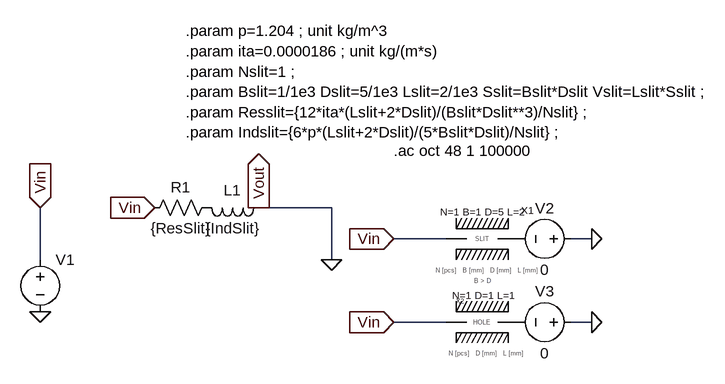
[diagram p0: schematic Slit_test.asc]
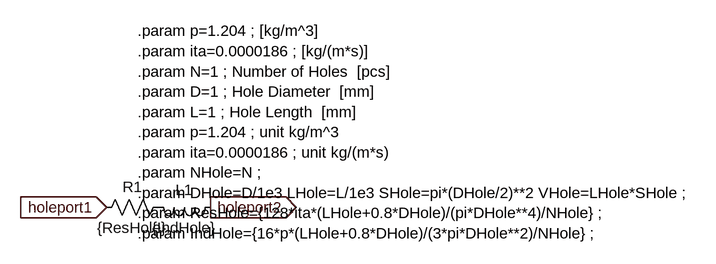
[diagram p1: sub-circuit holemodel.asc]
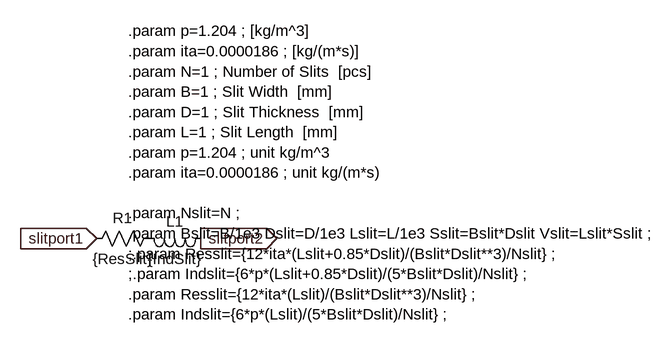
[diagram p2: sub-circuit slitmodel.asc]
Slit_test.asc, the LTspice schematic file:
Version 4
SHEET 1 1264 680
WIRE 432 432 320 432
WIRE 608 480 528 480
WIRE 832 480 800 480
WIRE -16 512 -16 432
WIRE 432 512 432 432
WIRE 608 608 528 608
WIRE 832 608 800 608
FLAG 160 432 Vin
IOPIN 160 432 In
FLAG 320 432 Vout
IOPIN 320 432 Out
FLAG -16 592 0
FLAG 432 512 0
FLAG -16 432 Vin
IOPIN -16 432 In
FLAG 832 480 0
FLAG 832 608 0
FLAG 528 608 Vin
IOPIN 528 608 In
FLAG 528 480 Vin
IOPIN 528 480 In
SYMBOL res 256 416 R90
WINDOW 0 0 56 VBottom 2
WINDOW 3 32 56 VTop 2
SYMATTR InstName R1
SYMATTR Value {ResSlit}
SYMBOL ind 336 416 R90
WINDOW 0 5 56 VBottom 2
WINDOW 3 32 56 VTop 2
SYMATTR InstName L1
SYMATTR Value {IndSlit}
SYMBOL voltage -16 496 R0
SYMATTR InstName V1
SYMATTR Value ""
SYMATTR Value2 AC 1
SYMBOL voltage 816 480 R90
WINDOW 0 -32 56 VBottom 2
WINDOW 3 32 56 VTop 2
SYMATTR InstName V2
SYMATTR Value 0
SYMATTR SpiceLine Rser=0
SYMBOL voltage 816 608 R90
WINDOW 0 -32 56 VBottom 2
WINDOW 3 32 56 VTop 2
SYMATTR InstName V3
SYMATTR Value 0
SYMATTR SpiceLine Rser=0
SYMBOL My_symbol/Holemodel 624 576 R0
WINDOW 0 0 0 Left 0
WINDOW 39 -6 -9 Left 1
SYMATTR InstName X2
SYMATTR SpiceLine N=1 D=1 L=1
SYMBOL My_symbol/SlitModel 624 448 R0
WINDOW 39 -25 -10 Left 1
SYMATTR InstName X1
SYMATTR SpiceLine N=1 B=1 D=5 L=2
TEXT 208 160 Left 2 !.param p=1.204 ; unit kg/m^3\n.param ita=0.0000186 ; unit kg/(m*s)\n.param Nslit=1 ;\n.param Bslit=1/1e3 Dslit=5/1e3 Lslit=2/1e3 Sslit=Bslit*Dslit Vslit=Lslit*Sslit ;\n.param Resslit={12*ita*(Lslit+2*Dslit)/(Bslit*Dslit**3)/Nslit} ;\n.param Indslit={6*p*(Lslit+2*Dslit)/(5*Bslit*Dslit)/Nslit} ;
TEXT 528 344 Left 2 !.ac oct 48 1 100000

holemodel.asc, the sub-circuit schematic file:
Version 4
SHEET 1 1216 680
FLAG 160 432 holeport1
IOPIN 160 432 In
FLAG 320 432 holeport2
IOPIN 320 432 Out
SYMBOL res 256 416 R90
WINDOW 0 0 56 VBottom 2
WINDOW 3 32 56 VTop 2
SYMATTR InstName R1
SYMATTR Value {ResHole}
SYMBOL ind 336 416 R90
WINDOW 0 5 56 VBottom 2
WINDOW 3 32 56 VTop 2
SYMATTR InstName L1
SYMATTR Value {IndHole}
TEXT 208 160 Left 2 !.param p=1.204 ; [kg/m^3]\n.param ita=0.0000186 ; [kg/(m*s)]\n.param N=1 ; Number of Holes  [pcs]\n.param D=1 ; Hole Diameter  [mm]\n.param L=1 ; Hole Length  [mm]\n.param p=1.204 ; unit kg/m^3\n.param ita=0.0000186 ; unit kg/(m*s)\n.param NHole=N ;\n.param DHole=D/1e3 LHole=L/1e3 SHole=pi*(DHole/2)**2 VHole=LHole*SHole ;\n.param ResHole={128*ita*(LHole+0.8*DHole)/(pi*DHole**4)/NHole} ;\n.param IndHole={16*p*(LHole+0.8*DHole)/(3*pi*DHole**2)/NHole} ;

slitmodel.asc, the sub-circuit schematic file:
Version 4
SHEET 1 1216 680
FLAG 160 432 slitport1
IOPIN 160 432 In
FLAG 320 432 slitport2
IOPIN 320 432 Out
SYMBOL res 256 416 R90
WINDOW 0 0 56 VBottom 2
WINDOW 3 32 56 VTop 2
SYMATTR InstName R1
SYMATTR Value {ResSlit}
SYMBOL ind 336 416 R90
WINDOW 0 5 56 VBottom 2
WINDOW 3 32 56 VTop 2
SYMATTR InstName L1
SYMATTR Value {IndSlit}
TEXT 208 112 Left 2 !.param p=1.204 ; [kg/m^3]\n.param ita=0.0000186 ; [kg/(m*s)]\n.param N=1 ; Number of Slits  [pcs]\n.param B=1 ; Slit Width  [mm]\n.param D=1 ; Slit Thickness  [mm]\n.param L=1 ; Slit Length  [mm]\n.param p=1.204 ; unit kg/m^3\n.param ita=0.0000186 ; unit kg/(m*s)\n \n.param Nslit=N ;\n.param Bslit=B/1e3 Dslit=D/1e3 Lslit=L/1e3 Sslit=Bslit*Dslit Vslit=Lslit*Sslit ;\n;.param Resslit={12*ita*(Lslit+0.85*Dslit)/(Bslit*Dslit**3)/Nslit} ;\n;.param Indslit={6*p*(Lslit+0.85*Dslit)/(5*Bslit*Dslit)/Nslit} ;\n.param Resslit={12*ita*(Lslit)/(Bslit*Dslit**3)/Nslit} ;\n.param Indslit={6*p*(Lslit)/(5*Bslit*Dslit)/Nslit} ;

The netlist it stands for:
* Slit_test.asc
R1 P001 Vin {ResSlit}
L1 0 P001 {IndSlit}
V1 Vin 0 AC 1
V2 0 P002 0 Rser=0
V3 0 P003 0 Rser=0
XX2 Vin P003 holemodel params: N=1 D=1 L=1
XX1 Vin P002 slitmodel params: N=1 B=1 D=5 L=2

* block symbol definitions
.subckt holemodel holeport1 holeport2
R1 P001 holeport1 {ResHole}
L1 holeport2 P001 {IndHole}
.param p=1.204 ; [kg/m^3]
.param ita=0.0000186 ; [kg/(m*s)]
.param N=1 ; Number of Holes  [pcs]
.param D=1 ; Hole Diameter  [mm]
.param L=1 ; Hole Length  [mm]
.param p=1.204 ; unit kg/m^3
.param ita=0.0000186 ; unit kg/(m*s)
.param NHole=N ;
.param DHole=D/1e3 LHole=L/1e3 SHole=pi*(DHole/2)**2 VHole=LHole*SHole ;
.param ResHole={128*ita*(LHole+0.8*DHole)/(pi*DHole**4)/NHole} ;
.param IndHole={16*p*(LHole+0.8*DHole)/(3*pi*DHole**2)/NHole} ;
.ends holemodel

.subckt slitmodel slitport1 slitport2
R1 P001 slitport1 {ResSlit}
L1 slitport2 P001 {IndSlit}
.param p=1.204 ; [kg/m^3]
.param ita=0.0000186 ; [kg/(m*s)]
.param N=1 ; Number of Slits  [pcs]
.param B=1 ; Slit Width  [mm]
.param D=1 ; Slit Thickness  [mm]
.param L=1 ; Slit Length  [mm]
.param p=1.204 ; unit kg/m^3
.param ita=0.0000186 ; unit kg/(m*s)
.param Nslit=N ;
.param Bslit=B/1e3 Dslit=D/1e3 Lslit=L/1e3 Sslit=Bslit*Dslit Vslit=Lslit*Sslit ;
;.param Resslit={12*ita*(Lslit+0.85*Dslit)/(Bslit*Dslit**3)/Nslit} ;
;.param Indslit={6*p*(Lslit+0.85*Dslit)/(5*Bslit*Dslit)/Nslit} ;
.param Resslit={12*ita*(Lslit)/(Bslit*Dslit**3)/Nslit} ;
.param Indslit={6*p*(Lslit)/(5*Bslit*Dslit)/Nslit} ;
.ends slitmodel

.param p=1.204 ; unit kg/m^3
.param ita=0.0000186 ; unit kg/(m*s)
.param Nslit=1 ;
.param Bslit=1/1e3 Dslit=5/1e3 Lslit=2/1e3 Sslit=Bslit*Dslit Vslit=Lslit*Sslit ;
.param Resslit={12*ita*(Lslit+2*Dslit)/(Bslit*Dslit**3)/Nslit} ;
.param Indslit={6*p*(Lslit+2*Dslit)/(5*Bslit*Dslit)/Nslit} ;
.ac oct 48 1 100000
.backanno
.end